# Altium schematic sheet HEBoard_AFE.SchDoc
size 431 x 279 mm; SheetNumber: 2; SheetTotal: 2
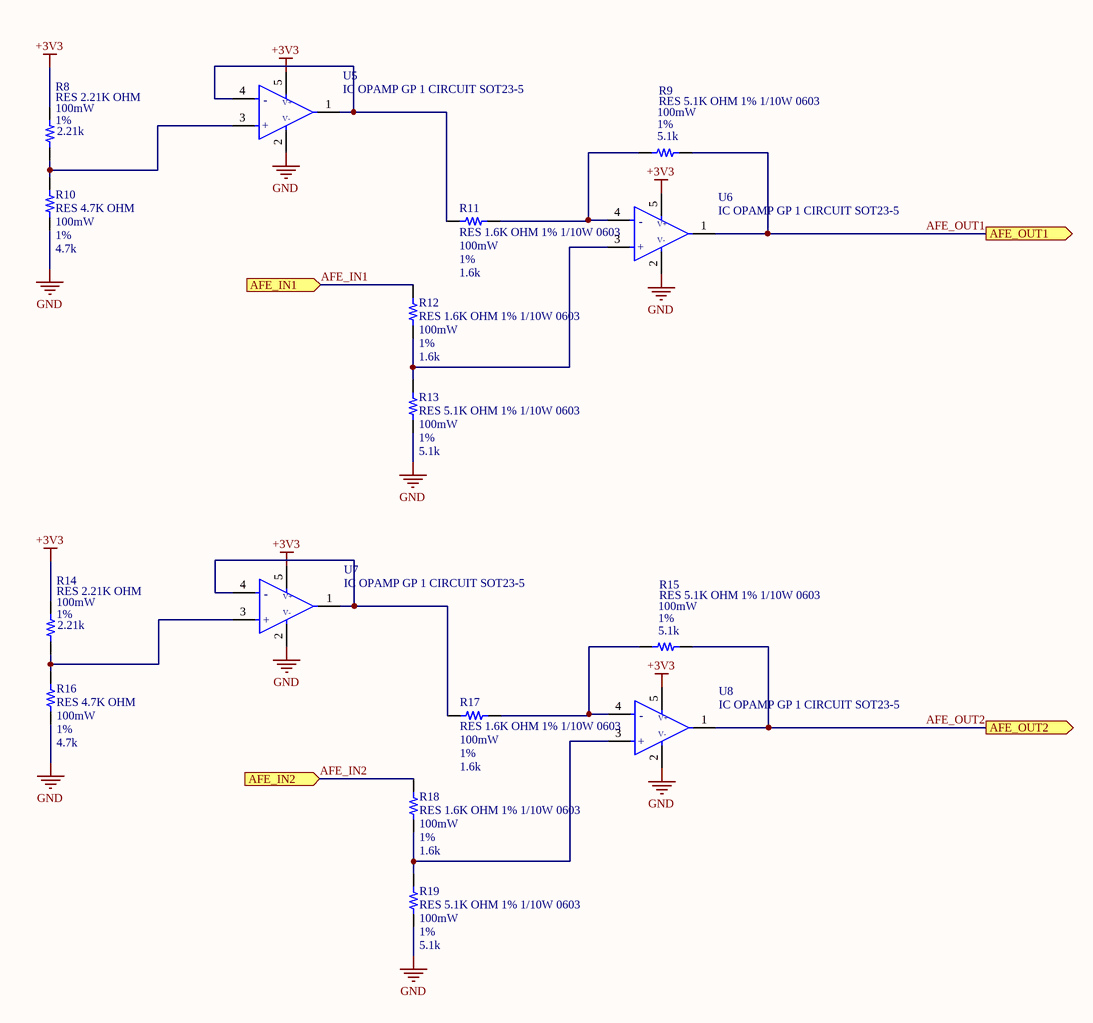
[diagram p0: HEBoard_AFE.SchDoc]

## Parts
R8  RES 2.21K OHM  Power Rating: 100mW  Tolerance: 1%  Resistance: 2.21k  [RES 0603_1608]
R9  RES 5.1K OHM 1% 1/10W 0603  Power Rating: 100mW  Tolerance: 1%  Resistance: 5.1k  [RES 0603_1608]
R10  RES 4.7K OHM  Power Rating: 100mW  Tolerance: 1%  Resistance: 4.7k  [RES 0603_1608]
R11  RES 1.6K OHM 1% 1/10W 0603  Power Rating: 100mW  Tolerance: 1%  Resistance: 1.6k  [RES 0603_1608]
R12  RES 1.6K OHM 1% 1/10W 0603  Power Rating: 100mW  Tolerance: 1%  Resistance: 1.6k  [RES 0603_1608]
R13  RES 5.1K OHM 1% 1/10W 0603  Power Rating: 100mW  Tolerance: 1%  Resistance: 5.1k  [RES 0603_1608]
R14  RES 2.21K OHM  Power Rating: 100mW  Tolerance: 1%  Resistance: 2.21k  [RES 0603_1608]
R15  RES 5.1K OHM 1% 1/10W 0603  Power Rating: 100mW  Tolerance: 1%  Resistance: 5.1k  [RES 0603_1608]
R16  RES 4.7K OHM  Power Rating: 100mW  Tolerance: 1%  Resistance: 4.7k  [RES 0603_1608]
R17  RES 1.6K OHM 1% 1/10W 0603  Power Rating: 100mW  Tolerance: 1%  Resistance: 1.6k  [RES 0603_1608]
R18  RES 1.6K OHM 1% 1/10W 0603  Power Rating: 100mW  Tolerance: 1%  Resistance: 1.6k  [RES 0603_1608]
R19  RES 5.1K OHM 1% 1/10W 0603  Power Rating: 100mW  Tolerance: 1%  Resistance: 5.1k  [RES 0603_1608]
U5  IC OPAMP GP 1 CIRCUIT SOT23-5  [SOT 23-5]
U6  IC OPAMP GP 1 CIRCUIT SOT23-5  [SOT 23-5]
U7  IC OPAMP GP 1 CIRCUIT SOT23-5  [SOT 23-5]
U8  IC OPAMP GP 1 CIRCUIT SOT23-5  [SOT 23-5]

## Ports
AFE_IN1 (in), AFE_IN2 (in), AFE_OUT1 (out), AFE_OUT2 (out)

## Nets
+3V3: R8.1 R14.1 U5.5(V+) U6.5(V+) U7.5(V+) U8.5(V+)
GND: R10.2 R13.1 R16.2 R19.1 U5.2(V-) U6.2(V-) U7.2(V-) U8.2(V-)
AFE_IN1: R12.2 ; port AFE_IN1
AFE_IN2: R18.2 ; port AFE_IN2
AFE_OUT1: R9.2 U6.1(OUT) ; port AFE_OUT1
AFE_OUT2: R15.2 U8.1(OUT) ; port AFE_OUT2
NetR8_2: R8.2 R10.1 U5.3(IN+)
NetR9_1: R9.1 R11.1 U6.4(IN-)
NetR11_2: R11.2 U5.1(OUT) U5.4(IN-)
NetR12_1: R12.1 R13.2 U6.3(IN+)
NetR14_2: R14.2 R16.1 U7.3(IN+)
NetR15_1: R15.1 R17.1 U8.4(IN-)
NetR17_2: R17.2 U7.1(OUT) U7.4(IN-)
NetR18_1: R18.1 R19.2 U8.3(IN+)

## Notes on the sheet
- DWG. NO.
- REV.
- SHT.
- THIS DOCUMENT AND THE DATA DISCLOSED HEREIN OR HEREWITH IS THE PROPERTY OF ALTIUM LIMITED AND MAY BE FREELY DISTRIBUTED IN WHOLE. NO RIGHTS ARE RESERVED OR EXPRESS OR IMPLIED WARANTEE GIVEN.
- REVISION
- DESCRIPTION
- DATE
- APPROVED
- ENG:
- APPROVALS
- PROJECT
- DSN:
- CHK:
- REFERENCE DOCUMENTS
- PROJECT REVISION:
- TITLE
- DOCUMENT REVISION:
- DESIGN ITEM:
- BOM:
- FAB DWG:
- PCB DWG:
- ASSY DWG:
- SCALE:
- SIZE
- B
- CAGE CODE
- FILE NAME
- DWG NO.
- SHEET
- OF
- REV
- (in symbol CMP-031-00034-5) -; +

## Library data of the parts
R8 R14 = CMP-010-0027-7: 2.21 kOhms ±1% 0.1W, 1/10W Chip Resistor 0603 (1608 Metric) Automotive AEC-Q200, Moisture Resistant Thick Film; Voltage Rating: 75V; Temperature Coefficient: 100ppm/°C; Case/Package: 0603
R9 R13 R15 R19 = CMP-00051-2: 5.1 kOhms ±1% 0.1W, 1/10W Chip Resistor 0603 (1608 Metric) Automotive AEC-Q200 Thick Film; Voltage Rating: 75V; Temperature Coefficient: 100ppm/°C; Case/Package: 0603
R10 R16 = CMP-010-0075-8: Fixed Resistor, Metal Glaze/thick Film, 0.1W, 4700ohm, 75V, 1% +/-Tol, 100ppm/Cel, Surface Mount, 0603; Temperature Coefficient: 100ppm/°C; Case/Package: 0603; Voltage Rating: 75V
R11 R12 R17 R18 = CMP-010-0019-7: 1.6 kOhms ±1% 0.1W, 1/10W Chip Resistor 0603 (1608 Metric) Moisture Resistant Thick Film; Voltage Rating: 75V; Temperature Coefficient: 100ppm/°C; Case/Package: 0603
U5-U8 = CMP-031-00034-5: General Purpose Amplifier 1 Circuit Rail-to-Rail SOT-23-5; Manufacturer 1: TI; Manufacturer Part Number: TLV9051IDBVR; Max Supply Voltage: 5.5V; Min Supply Voltage: 1.8V; Min Operating Temperature: -40°C; Mounting Technology: Surface Mount; Supplier 1: DigiKey; Case/Package: SOT-23-5; Max Operating Temperature: 125°C; Supplier Part Number 1: 296-TLV9051IDBVRCT-ND; Pins: 5